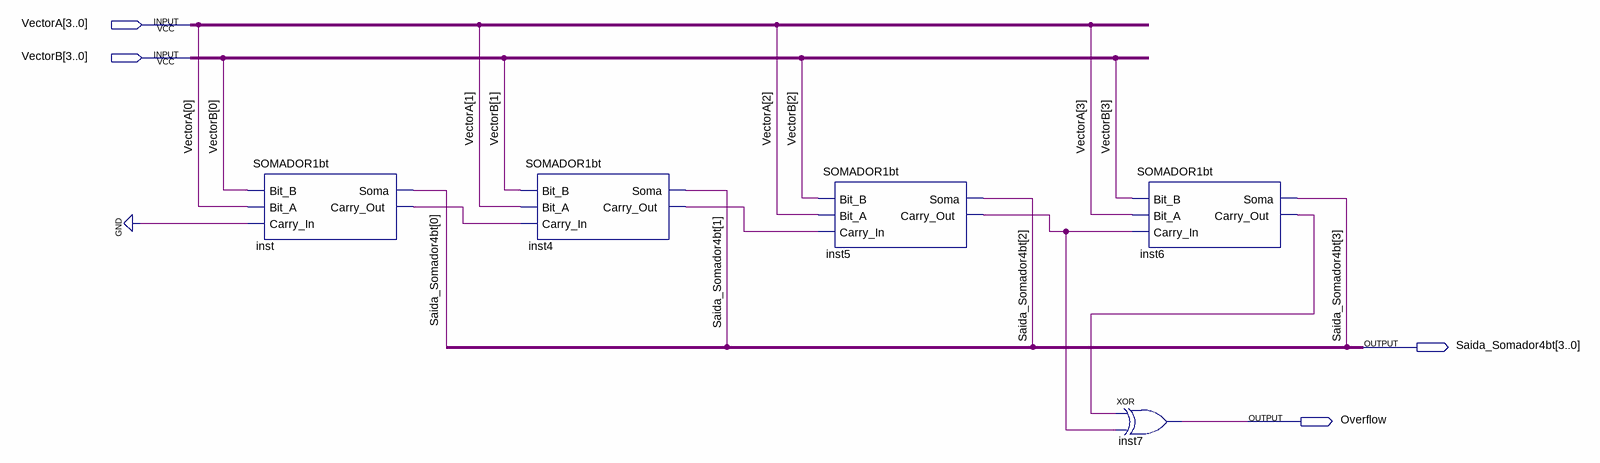
[diagram p0: schematic sheet]
// Quartus schematic SOMADOR4bt.bdf as structural Verilog: 5 symbols, 4 pins
module SOMADOR4bt (
  input  [3:0] VectorA,
  input  [3:0] VectorB,
  output [3:0] Saida_Somador4bt,
  output Overflow
);

  wire inst4_carry_out, inst5_carry_out, inst6_carry_out, inst_carry_out;

  SOMADOR1bt inst (
    .Bit_B(VectorB[0]), .Bit_A(VectorA[0]), .Carry_In(1'b0), .Soma(Saida_Somador4bt[0]),
    .Carry_Out(inst_carry_out));
  SOMADOR1bt inst4 (
    .Bit_B(VectorB[1]), .Bit_A(VectorA[1]), .Carry_In(inst_carry_out), .Soma(Saida_Somador4bt[1]),
    .Carry_Out(inst4_carry_out));
  SOMADOR1bt inst5 (
    .Bit_B(VectorB[2]), .Bit_A(VectorA[2]), .Carry_In(inst4_carry_out), .Soma(Saida_Somador4bt[2]),
    .Carry_Out(inst5_carry_out));
  SOMADOR1bt inst6 (
    .Bit_B(VectorB[3]), .Bit_A(VectorA[3]), .Carry_In(inst5_carry_out), .Soma(Saida_Somador4bt[3]),
    .Carry_Out(inst6_carry_out));
  xor inst7 (Overflow, inst6_carry_out, inst5_carry_out);
endmodule
